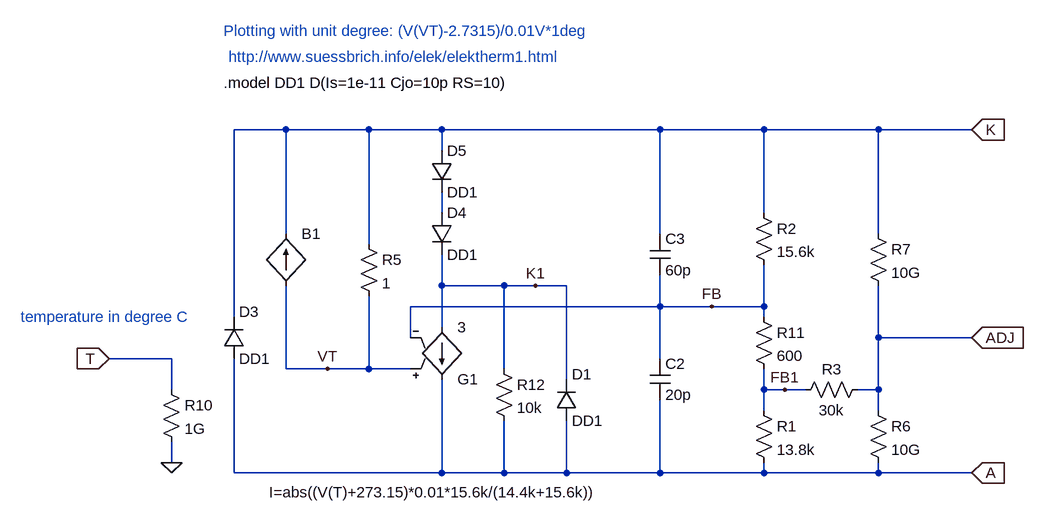
[diagram p0: schematic lm335x.asc]
lm335x.asc, the LTspice schematic file:
Version 4
SHEET 1 1380 680
WIRE -496 -256 -576 -256
WIRE -368 -256 -496 -256
WIRE -256 -256 -368 -256
WIRE 80 -256 -256 -256
WIRE 240 -256 80 -256
WIRE 416 -256 240 -256
WIRE 560 -256 416 -256
WIRE -256 -224 -256 -256
WIRE -256 -128 -256 -160
WIRE 240 -128 240 -256
WIRE -496 -96 -496 -256
WIRE 80 -96 80 -256
WIRE 416 -96 416 -256
WIRE -368 -80 -368 -256
WIRE -256 -16 -256 -64
WIRE -160 -16 -256 -16
WIRE -112 -16 -160 -16
WIRE -64 -16 -112 -16
WIRE 80 16 80 -32
WIRE 80 16 -304 16
WIRE 160 16 80 16
WIRE 240 16 240 -48
WIRE 240 16 160 16
WIRE -576 32 -576 -256
WIRE 240 32 240 16
WIRE -256 48 -256 -16
WIRE -304 64 -304 16
WIRE 416 64 416 -16
WIRE 560 64 416 64
WIRE -672 96 -768 96
WIRE 80 96 80 16
WIRE -496 112 -496 -16
WIRE -432 112 -496 112
WIRE -368 112 -368 0
WIRE -368 112 -432 112
WIRE -304 112 -368 112
WIRE -160 112 -160 -16
WIRE -64 128 -64 -16
WIRE -672 144 -672 96
WIRE 240 144 240 112
WIRE 272 144 240 144
WIRE 304 144 272 144
WIRE 416 144 416 64
WIRE 416 144 384 144
WIRE 240 176 240 144
WIRE 416 176 416 144
WIRE -672 256 -672 224
WIRE -576 272 -576 96
WIRE -256 272 -256 128
WIRE -256 272 -576 272
WIRE -160 272 -160 192
WIRE -160 272 -256 272
WIRE -64 272 -64 192
WIRE -64 272 -160 272
WIRE 80 272 80 160
WIRE 80 272 -64 272
WIRE 240 272 240 256
WIRE 240 272 80 272
WIRE 416 272 416 256
WIRE 416 272 240 272
WIRE 560 272 416 272
FLAG 560 -256 K
IOPIN 560 -256 In
FLAG 560 272 A
IOPIN 560 272 In
FLAG -432 112 VT
FLAG 160 16 FB
FLAG -768 96 T
IOPIN -768 96 In
FLAG 560 64 ADJ
IOPIN 560 64 In
FLAG -112 -16 K1
FLAG 272 144 FB1
FLAG -672 256 0
SYMBOL res 224 160 R0
SYMATTR InstName R1
SYMATTR Value 13.8k
SYMBOL res 224 -144 R0
SYMATTR InstName R2
SYMATTR Value 15.6k
SYMBOL res 288 160 R270
WINDOW 0 32 56 VTop 0
WINDOW 3 0 56 VBottom 0
SYMATTR InstName R3
SYMATTR Value 30k
SYMBOL g -256 144 M180
SYMATTR InstName G1
SYMATTR Value 3
SYMBOL res -384 -96 R0
SYMATTR InstName R5
SYMATTR Value 1
SYMBOL bi2 -496 -96 R0
WINDOW 3 -26 398 Left 0
SYMATTR Value I=abs((V(T)+273.15)*0.01*15.6k/(14.4k+15.6k))
SYMATTR InstName B1
SYMBOL res 400 160 R0
SYMATTR InstName R6
SYMATTR Value 10G
SYMBOL cap 64 96 R0
SYMATTR InstName C2
SYMATTR Value 20p
SYMBOL cap 64 -96 R0
SYMATTR InstName C3
SYMATTR Value 60p
SYMBOL res 400 -112 R0
SYMATTR InstName R7
SYMATTR Value 10G
SYMBOL res -688 128 R0
SYMATTR InstName R10
SYMATTR Value 1G
SYMBOL res 224 16 R0
SYMATTR InstName R11
SYMATTR Value 600
SYMBOL diode -592 96 M180
WINDOW 0 24 72 Left 0
WINDOW 3 24 0 Left 0
SYMATTR InstName D3
SYMATTR Value DD1
SYMBOL diode -272 -128 R0
SYMATTR InstName D4
SYMATTR Value DD1
SYMBOL res -176 96 R0
SYMATTR InstName R12
SYMATTR Value 10k
SYMBOL diode -272 -224 R0
SYMATTR InstName D5
SYMATTR Value DD1
SYMBOL diode -80 192 M180
WINDOW 0 24 72 Left 0
WINDOW 3 24 0 Left 0
SYMATTR InstName D1
SYMATTR Value DD1
TEXT -592 -328 Left 0 !.model DD1 D(Is=1e-11 Cjo=10p RS=10)
TEXT -592 -408 Left 0 ;Plotting with unit degree: (V(VT)-2.7315)/0.01V*1deg
TEXT -584 -368 Left 0 ;http://www.suessbrich.info/elek/elektherm1.html
TEXT -904 32 Left 0 ;temperature in degree C

The netlist it stands for:
* lm335x.asc
R1 FB1 A 13.8k
R2 K FB 15.6k
R3 FB1 ADJ 30k
G1 K1 A VT FB 3
R5 K VT 1
B1 VT K I=abs((V(T)+273.15)*0.01*15.6k/(14.4k+15.6k))
R6 ADJ A 10G
C2 FB A 20p
C3 K FB 60p
R7 K ADJ 10G
R10 T 0 1G
R11 FB FB1 600
D3 A K DD1
D4 N001 K1 DD1
R12 K1 A 10k
D5 K N001 DD1
D1 A K1 DD1
.model D D
.lib standard.dio
.model DD1 D(Is=1e-11 Cjo=10p RS=10)
* Plotting with unit degree: (V(VT)-2.7315)/0.01V*1deg
* http://www.suessbrich.info/elek/elektherm1.html
* temperature in degree C
.backanno
.end